# EAGLE design sinktheship (EAGLE 8.2.0)
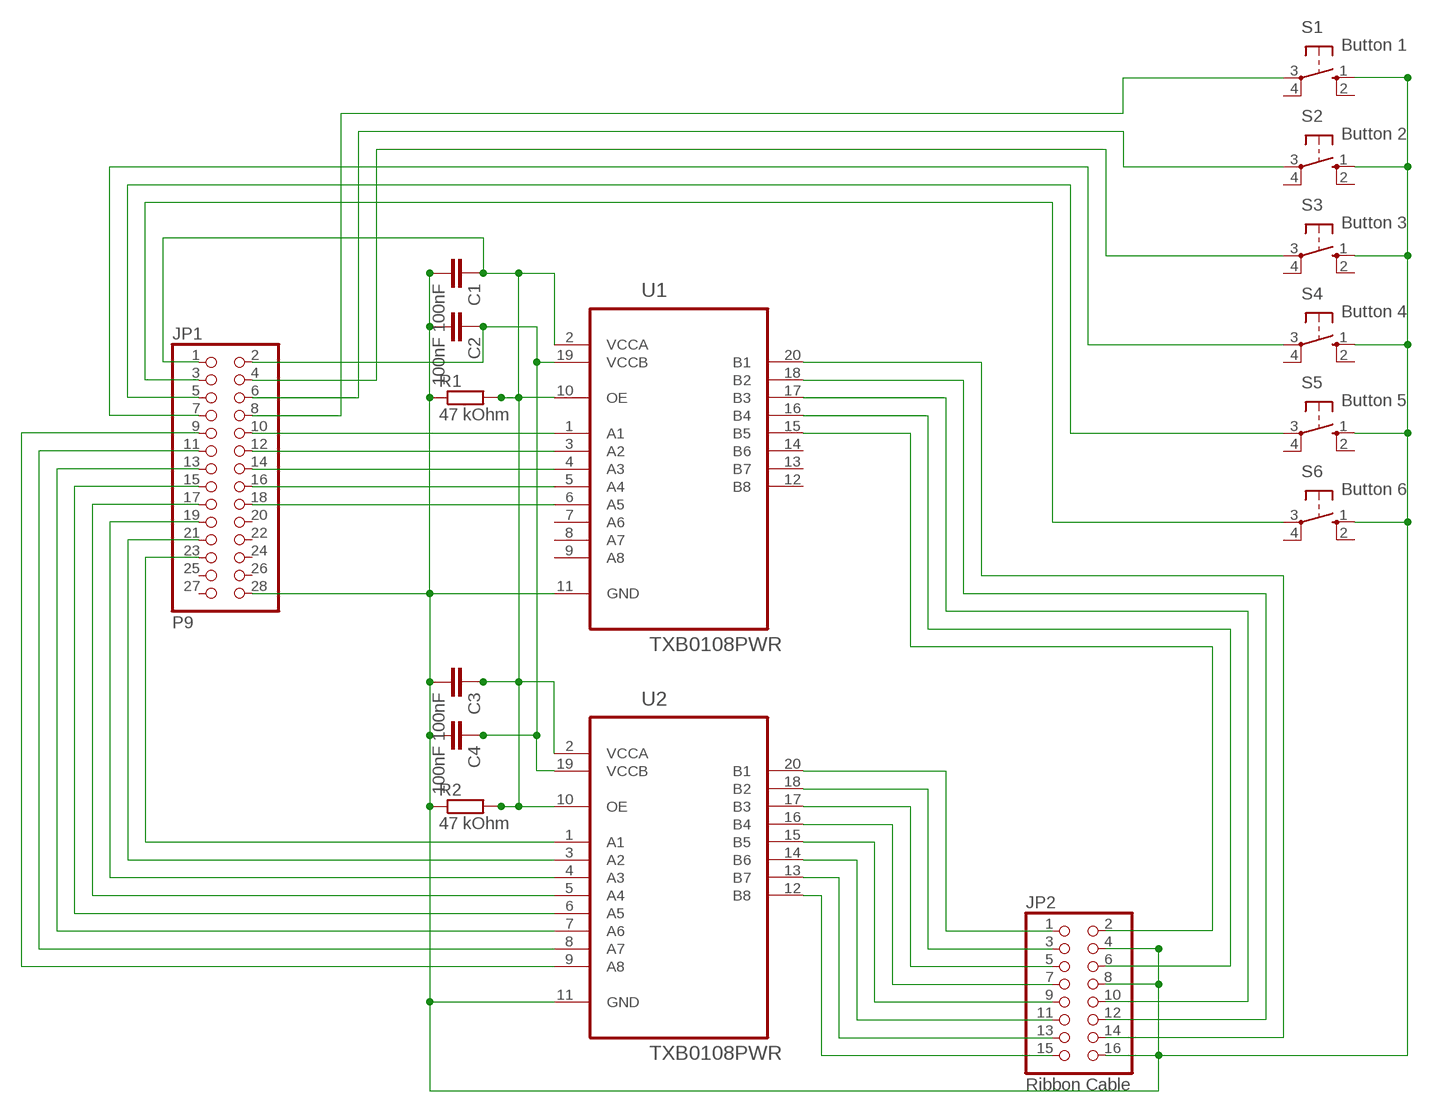
[diagram p0: schematic, sheet 1]

## Parts
C1  100nF  C-EUC0603  [C0603]
C2  100nF  C-EUC0603  [C0603]
C3  100nF  C-EUC0603  [C0603]
C4  100nF  C-EUC0603  [C0603]
JP1  P9  PINHD-2X14  [2X14]
JP2  Ribbon Cable  PINHD-2X8  [2X08]
R1  47 kOhm  R-EU_R0603  [R0603]
R2  47 kOhm  R-EU_R0603  [R0603]
S1  Button 1  10-XX  [B3F-10XX]
S2  Button 2  10-XX  [B3F-10XX]
S3  Button 3  10-XX  [B3F-10XX]
S4  Button 4  10-XX  [B3F-10XX]
S5  Button 5  10-XX  [B3F-10XX]
S6  Button 6  10-XX  [B3F-10XX]
U1  TXB0108PWR  [SOP65P640X120-20N]
U2  TXB0108PWR  [SOP65P640X120-20N]

## Nets
N$1: JP1.16 U1.5(A4)
N$2: JP2.15 U2.12(B8)
N$3: JP1.4 S3.3(P)
N$4: JP2.13 U2.13(B7)
N$5: JP1.10 U1.1(A1)
N$6: JP1.3 S6.3(P)
N$7: JP1.12 U1.3(A2)
N$8: JP1.18 U1.6(A5)
N$9: JP1.5 S5.3(P)
N$10: JP1.7 S4.3(P)
N$11: JP1.9 U2.9(A8)
N$12: JP1.14 U1.4(A3)
N$13: JP1.23 U2.1(A1)
N$14: JP1.21 U2.3(A2)
N$15: JP1.19 U2.4(A3)
N$16: JP1.17 U2.5(A4)
N$17: JP1.15 U2.6(A5)
N$18: JP1.13 U2.7(A6)
N$19: JP1.11 U2.8(A7)
N$20: JP2.11 U2.14(B6)
N$21: C1.2 C2.2 C3.2 C4.2 JP1.28 JP2.4 JP2.8 JP2.16 R1.1 R2.1 S1.1(S) S2.1(S) S3.1(S) S4.1(S) S5.1(S) S6.1(S) U1.11(GND) U2.11(GND)
N$23: JP2.9 U2.15(B5)
N$24: JP2.7 U2.16(B4)
N$25: JP2.5 U2.17(B3)
N$26: JP2.3 U2.18(B2)
N$27: JP2.1 U2.20(B1)
N$28: JP2.14 U1.20(B1)
N$29: JP2.12 U1.18(B2)
N$30: JP2.10 U1.17(B3)
N$31: JP2.6 U1.16(B4)
N$32: JP2.2 U1.15(B5)
N$34: JP1.6 S2.3(P)
N$35: JP1.8 S1.3(P)
VCCA: C1.1 C3.1 JP1.1 R1.2 R2.2 U1.2(VCCA) U1.10(OE) U2.2(VCCA) U2.10(OE)
VCCB: C2.1 C4.1 JP1.2 U1.19(VCCB) U2.19(VCCB)
Unconnected: JP1.20 JP1.22 JP1.24 JP1.25 JP1.26 JP1.27 S1.2(S1) S1.4(P1) S2.2(S1) S2.4(P1) S3.2(S1) S3.4(P1) S4.2(S1) S4.4(P1) S5.2(S1) S5.4(P1) S6.2(S1) S6.4(P1) U1.7(A6) U1.8(A7) U1.9(A8) U1.12(B8) U1.13(B7) U1.14(B6)

## Library data of the parts
C1-C4 = s1:C-EU: CAPACITOR, European symbol
JP1 = s1:PINHD-2X14: PIN HEADER
JP2 = s1:PINHD-2X8: PIN HEADER
R1 R2 = s1:R-EU_: RESISTOR, European symbol
S1-S6 = s1:10-XX: OMRON SWITCH; MPN: B3F-1000; OC_FARNELL: 176432; OC_NEWARK: 36M3542
U1 U2 = s1:TXB0108PWR: 8-BIT BIDIRECTIONAL VOLTAGE-LEVEL TRANSLATOR; MPN: TXB0108PWR; OC_FARNELL: 1494945; OC_NEWARK: 27M1151; PACKAGE: TSSOP-20; SUPPLIER: Texas Instruments

## Board
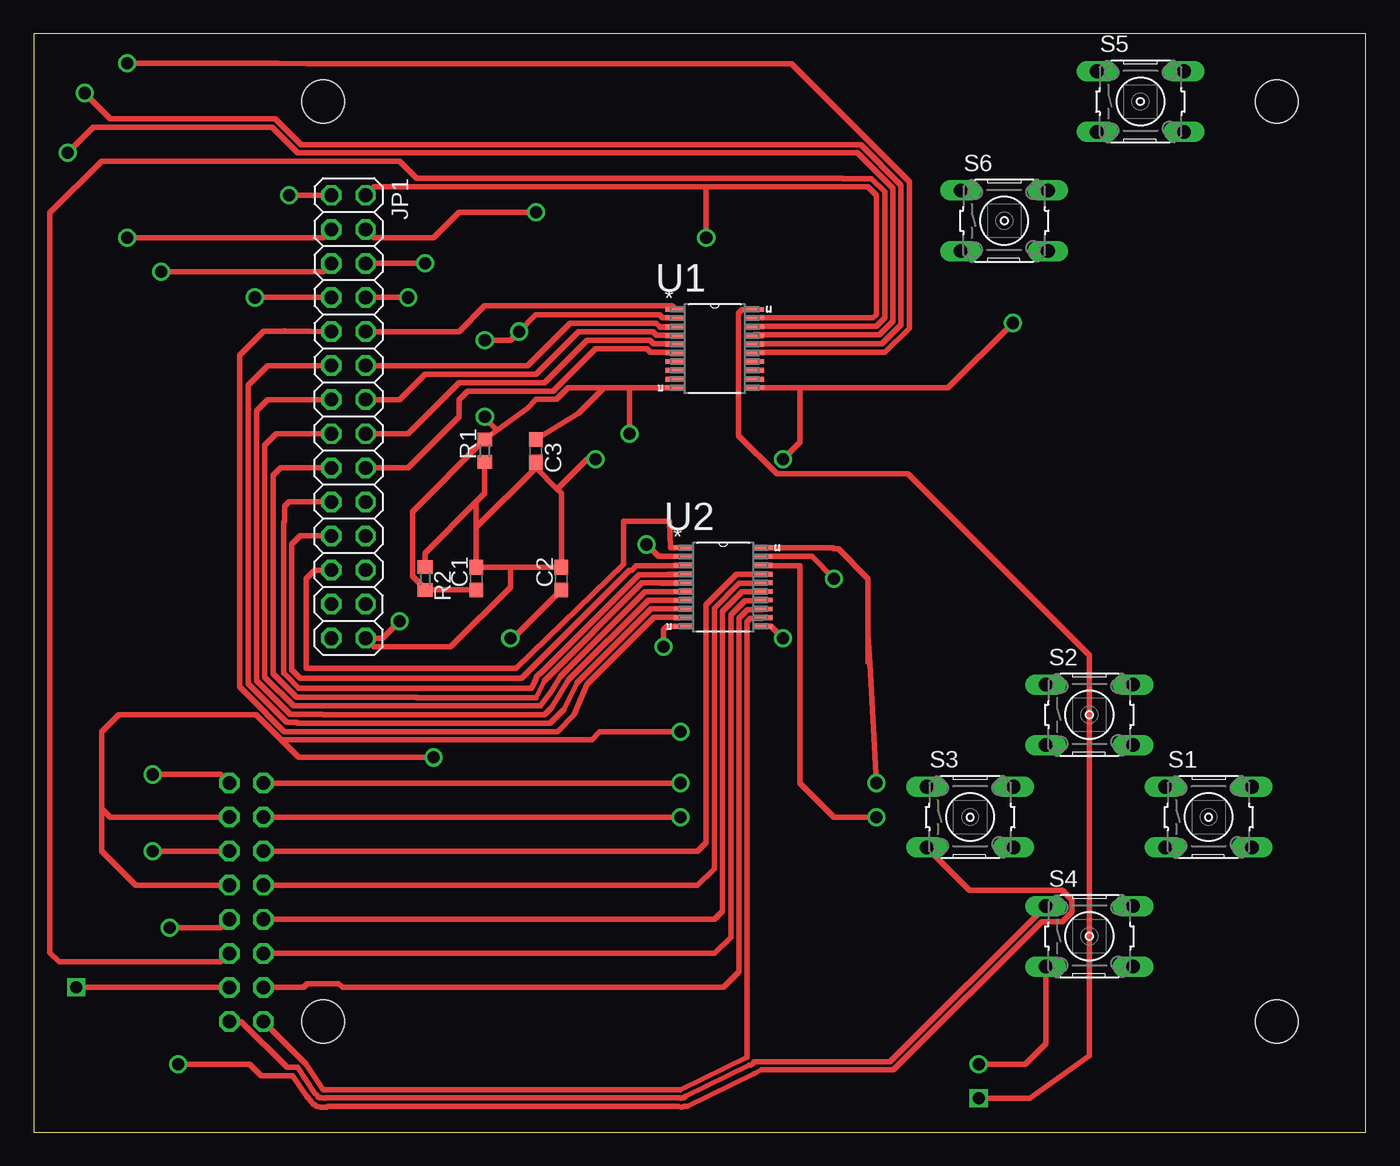
[diagram p1: board, top side]
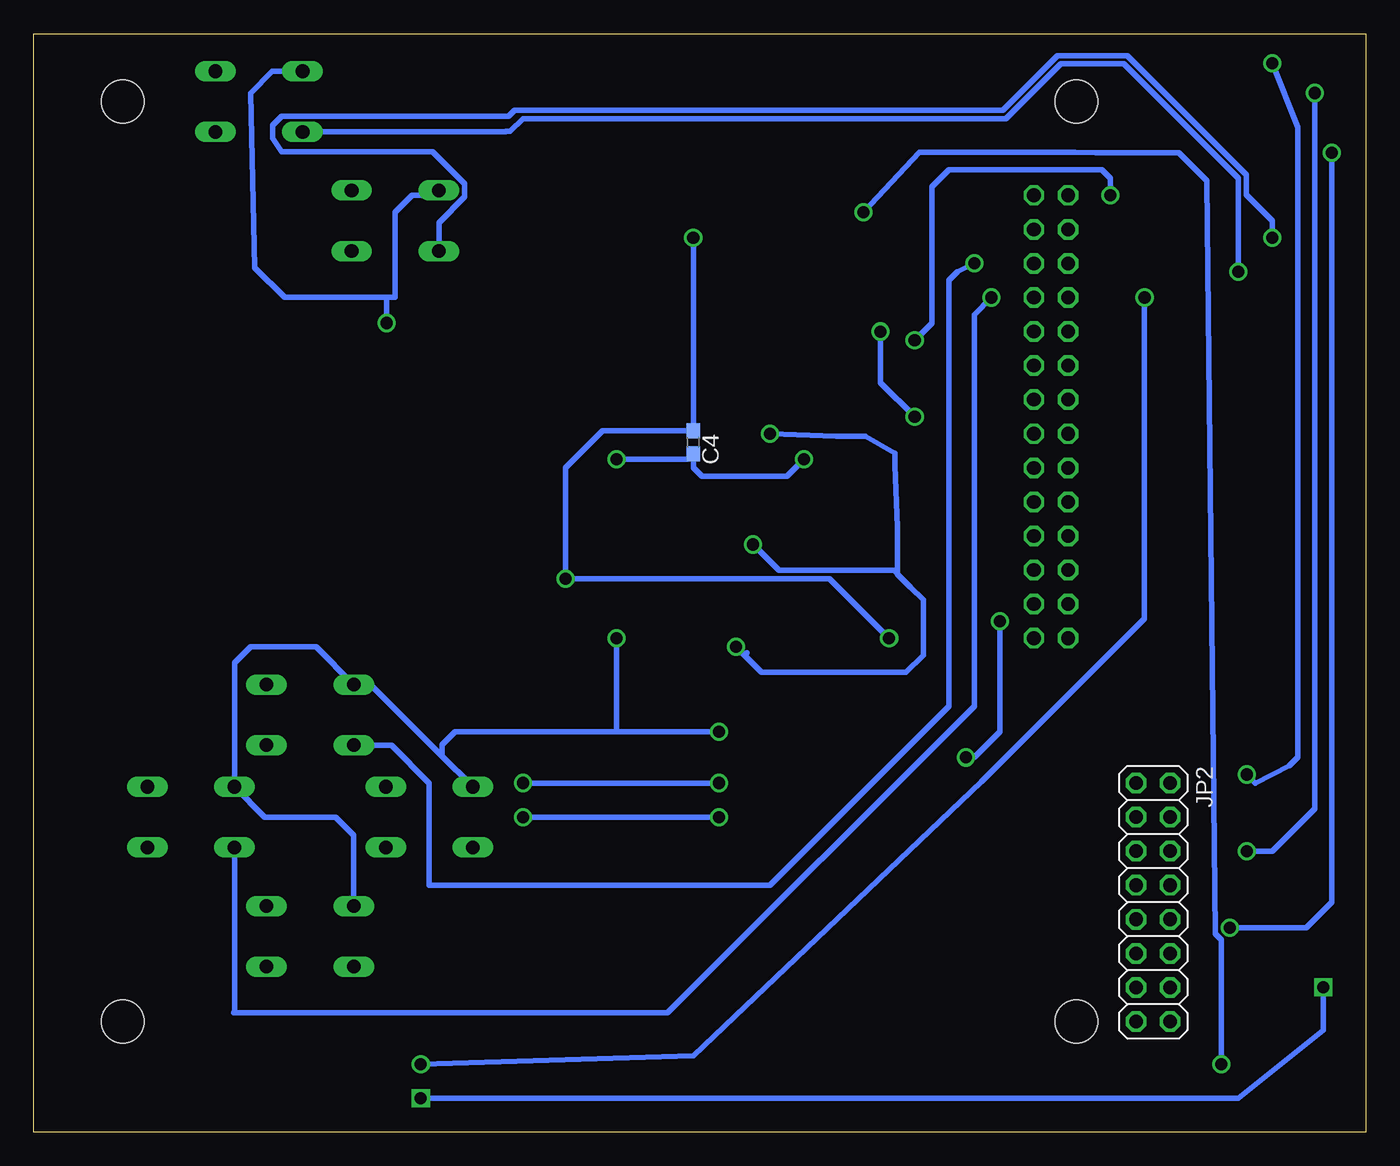
[diagram p2: board, bottom side, seen from below]

Size 99.36 x 81.91 mm. Coordinates in mm from the lower left corner, seen from the top.
Outline: 0,0 99.36,0 99.36,81.91 0,81.91 0,0
Copper layers (1*16): Top 0.035mm / dielectric 1.5mm / Bottom 0.035mm
Design rules "default": minimum track width 10mil, minimum drill 24mil, track to track 8mil, track to pad 8mil, pad to pad 8mil, via to via 8mil, smd to smd 8mil, copper to edge 40mil, drill to drill 8mil, minimum pad ring 10mil, minimum via ring 8mil, stop-mask expansion 4mil, vias tented up to drill 0mil, thermal gap 10mil
Holes 3.2 mm at 21.59,8.25 92.71,76.84 21.59,76.84 92.71,8.25

### Footprints (pad centres in the part's own frame; a part is rotated, then mirrored left to right if it is on the bottom)
C0603 = smd 1.1 x 1: 1 -0.85,0; 2 0.85,0
2X14 = drill 1.016 octagon: 1 -16.51,-1.27; 2 -16.51,1.27; 3 -13.97,-1.27; 4 -13.97,1.27; 5 -11.43,-1.27; 6 -11.43,1.27; 7 -8.89,-1.27; 8 -8.89,1.27; 9 -6.35,-1.27; 10 -6.35,1.27; 11 -3.81,-1.27; 12 -3.81,1.27; 13 -1.27,-1.27; 14 -1.27,1.27; 15 1.27,-1.27; 16 1.27,1.27; 17 3.81,-1.27; 18 3.81,1.27; 19 6.35,-1.27; 20 6.35,1.27; 21 8.89,-1.27; 22 8.89,1.27; 23 11.43,-1.27; 24 11.43,1.27; 25 13.97,-1.27; 26 13.97,1.27; 27 16.51,-1.27; 28 16.51,1.27
2X08 = drill 1.016 octagon: 1 -8.89,-1.27; 2 -8.89,1.27; 3 -6.35,-1.27; 4 -6.35,1.27; 5 -3.81,-1.27; 6 -3.81,1.27; 7 -1.27,-1.27; 8 -1.27,1.27; 9 1.27,-1.27; 10 1.27,1.27; 11 3.81,-1.27; 12 3.81,1.27; 13 6.35,-1.27; 14 6.35,1.27; 15 8.89,-1.27; 16 8.89,1.27
R0603 = smd 1 x 1.1: 1 -0.85,0; 2 0.85,0
B3F-10XX = drill 1.016 long: 1 -3.251,2.261; 2 3.251,2.261; 3 -3.251,-2.261; 4 3.251,-2.261
SOP65P640X120-20N = smd 1.473 x 0.356: 1 -2.921,2.921; 2 -2.921,2.286; 3 -2.921,1.626; 4 -2.921,0.965; 5 -2.921,0.33; 6 -2.921,-0.33; 7 -2.921,-0.965; 8 -2.921,-1.626; 9 -2.921,-2.286; 10 -2.921,-2.921; 11 2.921,-2.921; 12 2.921,-2.286; 13 2.921,-1.626; 14 2.921,-0.965; 15 2.921,-0.33; 16 2.921,0.33; 17 2.921,0.965; 18 2.921,1.626; 19 2.921,2.286; 20 2.921,2.921

### Placement (x,y rotation side)
C1  33.02,41.27 90 top
C2  39.37,41.27 90 top
C3  37.46,50.8 270 top
C4  50.16,51.44 270 bottom
JP1  23.49,53.34 270 top
JP2  15.88,17.14 270 bottom
R1  33.66,50.8 90 top
R2  29.21,41.27 270 top
S1  87.63,23.5 0 top
S2  78.74,31.12 0 top
S3  69.85,23.5 0 top
S4  78.74,14.61 0 top
S5  82.55,76.84 0 top
S6  72.39,67.94 0 top
U1  50.8,58.42 0 top
U2  51.44,40.64 0 top

### Tracks (layer width: path | path; a pad name or v marks a point on that pad's centre or on a via)
N$1
  Top 0.406: JP1.16 27.94,52.07 31.75,55.88 38.1,55.88 41.27,59.05 45.96,59.05 46.24,58.78 47.85,58.78 U1.5
N$2
  Top 0.406: U2.12 54.33,38.33 53.48,38.33 53.21,38.06 53.21,5.59 48.26,3.17 21.59,3.17 20.32,5.08 JP2.15
N$3  (via drill 0.9)
  Top 0.406: 48.77,1.96 48.54,1.96 48.34,1.86 48.06,1.96 21.96,1.96 21.85,1.88 21.46,1.88 21.08,1.96 20.99,2.05 20.86,2.08 20.67,2.36 20.61,2.37 20.51,2.53 20.37,2.67 19.34,4.22 16.99,4.22 16.13,5.08 v10.79,5.08 | 48.77,1.96 53.72,4.37 54.29,4.65 64.13,4.65 75.18,15.7 76.73,15.7 77.42,16.38 77.42,17.35 76.73,18.03 69.8,18.03 S3.3 | 48.77,1.96 | v37.46,68.58 31.75,68.58 29.84,66.68 25.4,66.68 JP1.4
  Bottom 0.406: v10.79,5.08 10.79,14.35 11.24,14.79 11.88,70.93 13.97,73.03 20.14,73.03 21.69,73.06 33.3,73.06 v37.46,68.58
N$4
  Top 0.406: U2.13 54.3,38.96 53.25,38.96 52.6,38.32 52.6,11.96 51.44,10.79 23.04,10.79 22.76,11.07 20.42,11.07 20.14,10.79 JP2.13
N$5
  Top 0.406: 29.84,59.69 JP1.10 | 29.84,59.69 30.48,59.69 | 40.64,61.6 41.59,61.6 | 41.59,61.6 47.62,61.6 U1.1 | 41.59,61.6 33.66,61.6 31.75,59.69 29.84,59.69
N$6  (via drill 0.9)
  Top 0.406: v6.99,66.68 21.59,66.68 JP1.3
  Bottom 0.406: S6.3 69.14,67.79 67.21,69.72 67.21,70.69 69.61,73.09 80.86,73.09 81.55,74.09 81.55,75.06 80.86,75.74 63.96,75.74 63.5,76.2 27.07,76.2 23.01,80.26 17.81,80.26 8.92,71.37 8.92,69.88 6.99,67.94 v6.99,66.68
N$7
  Top 0.406: JP1.12 36.83,57.15 40,60.32 46.42,60.32 46.7,60.04 | 46.7,60.04 46.72,60.02 47.88,60.02 | 46.7,60.04 U1.3
N$8
  Top 0.406: U1.6 47.83,58.14 46.02,58.14 45.73,58.42 41.91,58.42 38.73,55.24 32.38,55.24 31.75,54.61 31.75,53.34 27.94,49.53 JP1.18
N$9  (via drill 0.9)
  Top 0.406: v9.53,64.13 21.59,64.13 JP1.5
  Bottom 0.406: v9.53,64.13 9.53,71.12 18.06,79.65 22.76,79.65 26.85,75.56 62.86,75.56 63.82,74.61 64.14,74.61 64.17,74.57 S5.3
N$10  (via drill 0.9)
  Top 0.406: v16.51,62.23 JP1.7 | v70.48,5.08 73.98,5.08 75.49,6.59 S4.3
  Bottom 0.406: v70.48,5.08 50.16,5.71 28.66,26.12 16.51,38.28 v16.51,62.23
N$11
  Top 0.406: 16.03,32.54 15.42,33.16 | 16.03,32.54 18.7,29.87 39.08,29.87 40.32,31.12 41.27,33.38 46.27,38.38 47.86,38.38 47.89,38.35 U2.9 | JP1.9 20.64,59.72 | 20.64,59.72 18.73,59.76 | 20.64,59.72 17.17,59.72 15.37,57.91 15.37,56.71 15.37,56.52 15.37,33.21 16.03,32.54
N$12
  Top 0.406: JP1.14 27.3,54.61 29.21,56.52 37.46,56.52 40.64,59.69 46.19,59.69 46.47,59.41 47.85,59.41 U1.4
N$13
  Top 0.406: JP1.23 20.95,41.91 20.32,41.27 20.32,34.61 35.97,34.61 44,42.33 44,45.53 45.27,45.53 47.44,45.53 47.5,43.56 U2.1
N$14
  Top 0.406: JP1.21 19.9,44.45 19.26,43.81 19.26,34.48 19.89,33.86 36.4,33.86 44.45,41.91 44.63,41.91 44.94,42.21 48.46,42.21 U2.3
N$15
  Top 0.406: 47.62,41.58 47.36,41.58 | 48.26,41.58 47.62,41.58 | 48.26,41.58 48.51,41.58 | 47.62,41.58 47.65,41.6 U2.4 48.49,41.58 | 21.43,46.99 JP1.19 19.05,46.99 18.73,46.67 18.73,45.56 18.65,45.48 18.65,34.23 | 18.65,34.23 18.82,34.06 | 18.82,34.06 19.77,33.11 37.15,33.11 37.49,33.8 37.49,33.91 37.6,34.02 37.67,34.15 37.77,34.19 45.14,41.55 48.23,41.55 48.26,41.58 | 18.82,34.06 18.65,34.23
N$16
  Top 0.406: U2.5 48.46,40.92 47.62,40.92 | 47.62,40.92 46.78,40.92 | 47.62,40.92 47.6,40.95 45.39,40.95 38.1,33.66 37.46,32.38 28.57,32.38 28.55,32.41 19.61,32.41 17.86,34.17 17.86,48.97 18.41,49.53 JP1.17
N$17
  Top 0.406: U2.6 45.62,40.31 39.31,34 38.67,32.96 37.81,31.77 19.39,31.77 17.25,33.91 17.25,51.22 18.1,52.07 JP1.15
N$18
  Top 0.406: U2.7 45.84,39.67 39.92,33.75 38.65,31.66 38.1,31.12 21.59,31.12 21.54,31.17 19.13,31.17 16.64,33.66 16.64,51.47 | JP1.13 17.46,54.61 16.64,53.78 16.64,52.58 | 16.64,52.58 | 16.64,52.58 16.64,51.47 | 16.64,51.47
N$19
  Top 0.406: 47.69,39.01 U2.8 46.05,39.01 40.53,33.49 39.57,31.55 38.51,30.48 19.68,30.48 19.61,30.56 18.88,30.56 16.01,33.43 16.01,53.89 | 16.01,53.89 15.99,55.68 17.46,57.15 JP1.11 | 16.01,53.89 16.03,53.88
N$20
  Top 0.406: U2.14 54.3,39.62 53.05,39.62 51.99,38.57 51.99,14.53 50.8,13.34 JP2.11
N$21  (via drill 0.9)
  Top 0.406: R1.1 33.66,47.62 33.02,46.99 | 33.02,46.99 29.21,43.18 R2.1 | 33.02,45.09 C1.2 35.56,42.12 | 33.02,45.09 33.02,46.99 | 37.46,49.53 C3.2 | 37.46,49.53 33.02,45.09 | 39.05,47.94 39.37,47.62 C2.2 35.56,42.12 | 39.05,47.94 37.46,49.53 | 35.56,42.12 35.56,40.64 31.12,36.2 25.4,36.2 JP1.28 26.04,36.83 v27.3,38.1 | v41.91,50.16 41.27,50.16 39.05,47.94 | JP2.16 15.49,8.25 18.92,4.83 19.71,4.83 20.98,2.92 21.12,2.79 21.22,2.63 21.29,2.61 21.34,2.56 21.53,2.56 21.72,2.53 21.77,2.56 48.16,2.56 48.3,2.52 48.4,2.56 48.51,2.56 48.62,2.67 53.35,4.98 53.47,4.98 53.57,5.08 53.71,5.15 53.74,5.26 63.88,5.26 S4.1 | JP2.8 7.62,18.41 5.08,20.95 5.08,24.13 | 5.08,24.13 5.08,29.84 6.35,31.12 16.6,31.12 18.45,29.26 | JP2.4 5.71,23.5 5.08,24.13 | U1.11 57.15,55.5 | 57.15,55.5 68.2,55.5 v73.03,60.32 | 57.15,55.5 57.15,51.44 v55.88,50.16 | U2.11 54.99,37.72 v55.88,36.83 | v29.84,27.94 19.77,27.94 18.45,29.26 | v48.26,29.84 42.23,29.84 41.64,29.26 18.45,29.26
  Bottom 0.406: S4.1 75.49,22.15 76.83,23.5 82.12,23.5 S1.1 84.38,35 83.19,36.2 78.31,36.2 S2.1 74.22,33.38 69,28.16 | 69,28.16 S3.1 | v41.91,50.16 43.18,48.9 49.53,48.9 50.16,49.53 C4.2 50.59,50.16 v55.88,50.16 | S5.1 81.56,79.1 83.19,77.47 82.87,64.45 80.64,62.23 73.03,62.23 | 73.03,62.23 72.39,62.23 72.39,68.58 71.12,69.85 69.49,69.85 S6.1 | v48.26,29.84 55.88,29.84 | v73.03,60.32 73.03,62.23 | v55.88,36.83 55.88,29.84 | v27.3,38.1 27.3,29.84 29.21,27.94 v29.84,27.94 | 69,28.16 68.9,28.26 68.9,28.89 67.94,29.84 55.88,29.84
N$23
  Top 0.406: U2.15 54.33,40.28 52.85,40.28 51.38,38.82 51.38,16.46 50.8,15.88 JP2.9
N$24
  Top 0.406: U2.16 54.3,40.92 52.62,40.92 50.77,39.08 50.77,19.66 49.53,18.41 JP2.7
N$25
  Top 0.406: U2.17 54.33,41.58 52.42,41.58 50.16,39.33 50.16,21.59 49.53,20.95 JP2.5
N$26  (via drill 0.9)
  Top 0.406: JP2.3 v48.26,23.5 | U2.18 54.41,42.21 57.14,42.21 57.15,39.37 57.15,38.73 | 57.15,38.4 57.15,38.73 | 57.15,38.73 57.15,28.58 57.15,26.04 59.69,23.5 v62.86,23.5
  Bottom 0.406: v48.26,23.5 v62.86,23.5
N$27  (via drill 0.9)
  Top 0.406: 62.36,34.91 v62.86,26.04 | 62.36,34.91 62.23,37.18 | JP2.1 v48.26,26.04 | U2.20 59.63,43.56 59.69,43.5 60.01,43.5 62.23,41.27 62.23,35.04 62.36,34.91
  Bottom 0.406: v48.26,26.04 v62.86,26.04
N$28  (via drill 0.9)
  Top 0.406: U1.20 53.7,61.32 52.84,61.32 52.58,61.05 52.58,51.94 55.43,49.08 65.22,49.08 78.74,35.56 78.74,5.71 74.3,2.54 v70.48,2.54 | v3.17,10.79 JP2.14
  Bottom 0.406: v70.48,2.54 9.53,2.54 3.17,7.62 v3.17,10.79
N$29
  Top 0.406: U1.18 53.77,60.1 62.86,60.1 63.47,60.71 63.47,70.1 62.48,71.09 60.35,71.09 60.32,71.12 28.57,71.12 27.3,72.39 5.08,72.39 1.22,68.53 1.22,13.39 1.91,12.7 13.97,12.7 JP2.12
N$30  (via drill 0.9)
  Top 0.406: U1.17 53.77,59.44 63.06,59.44 64.08,60.46 64.08,70.35 61.44,73 19.71,73 17.78,74.93 4.44,74.93 v2.54,73.03 | v10.16,15.24 13.97,15.24 JP2.10
  Bottom 0.406: v2.54,73.03 2.54,17.14 4.44,15.24 v10.16,15.24
N$31  (via drill 0.9)
  Top 0.406: U1.16 53.75,58.78 63.27,58.78 64.69,60.2 64.69,70.61 61.69,73.61 19.96,73.61 18.03,75.54 17.17,75.54 17.14,75.56 5.71,75.56 v3.81,77.47 | v8.89,20.95 JP2.6
  Bottom 0.406: v3.81,77.47 3.81,24.13 6.99,20.95 v8.89,20.95
N$32  (via drill 0.9)
  Top 0.406: v6.99,79.69 18.24,79.69 20.42,79.65 56.51,79.65 65.3,70.86 65.3,59.95 63.49,58.14 53.77,58.14 U1.15 | v8.89,26.67 13.97,26.67 JP2.2
  Bottom 0.406: v6.99,79.69 5.08,74.93 5.08,27.94 5.71,27.3 8.26,26.04 v8.89,26.67
N$34  (via drill 0.9)
  Top 0.406: v29.21,64.77 JP1.6
  Bottom 0.406: S2.3 72.67,28.85 69.85,26.04 69.85,18.41 44.45,18.41 31.12,31.75 31.12,63.5 30.48,64.13 v29.21,64.77
N$35  (via drill 0.9)
  Top 0.406: v27.94,62.23 JP1.8
  Bottom 0.406: S1.3 84.38,8.97 84.45,8.89 52.07,8.89 29.21,31.75 29.21,60.96 v27.94,62.23
VCCA  (via drill 0.9)
  Top 0.406: 44.45,55.5 42.55,55.5 | 44.45,55.5 U1.10 | 42.55,55.5 39.85,55.5 38.99,54.63 37.49,54.63 36.83,53.98 34.57,52.32 | 34.57,52.32 R1.2 28.25,46.25 28.25,41.46 29.21,40.5 R2.2 C1.1 | C3.1 40.64,53.59 42.55,55.5 | U1.2 46.9,60.71 46.67,60.93 37.44,60.93 v36.2,59.69 35.56,59.05 v33.66,59.05 | v33.66,53.34 33.66,53.24 34.57,52.32 | JP1.1 v19.05,69.85 | U2.2 46.61,42.93 v45.72,43.81 | v44.45,52.07 44.45,55.5 | v46.99,36.2 46.99,37.46 47.24,37.72 U2.10
  Bottom 0.406: v36.2,59.69 36.2,55.88 v33.66,53.34 | v19.05,69.85 19.05,71.12 19.68,71.75 31.12,71.75 32.38,70.49 32.38,60.32 v33.66,59.05 | v45.72,43.81 43.79,41.88 39.37,41.88 | 46.17,35.75 46.35,35.56 v46.99,36.2 45.09,34.29 34.29,34.29 33.02,35.56 33.02,39.69 33.97,40.64 | 39.37,41.88 39.09,41.88 | v44.45,52.07 39.5,51.88 37.34,51.88 35.11,50.61 35.11,49.72 34.94,45.09 | 34.92,44.83 34.94,45.09 | 34.94,45.09 34.94,41.6 33.97,40.64 | 39.37,41.88 35.22,41.88 33.97,40.64
VCCB  (via drill 0.9)
  Top 0.406: U2.19 58.04,42.93 v59.69,41.27 | v35.56,36.83 35.77,36.83 C2.1 | U1.19 62.61,60.71 62.86,60.96 62.86,69.85 62.23,70.49 50.16,70.49 | 50.16,70.49 25.4,70.49 JP1.2 | v50.16,66.68 50.16,70.49
  Bottom 0.406: v35.56,36.83 40,41.27 v59.69,41.27 59.69,49.53 57.63,51.59 | 57.63,51.59 57.15,52.07 | v50.16,66.68 C4.1 56.94,52.28 57.63,51.59